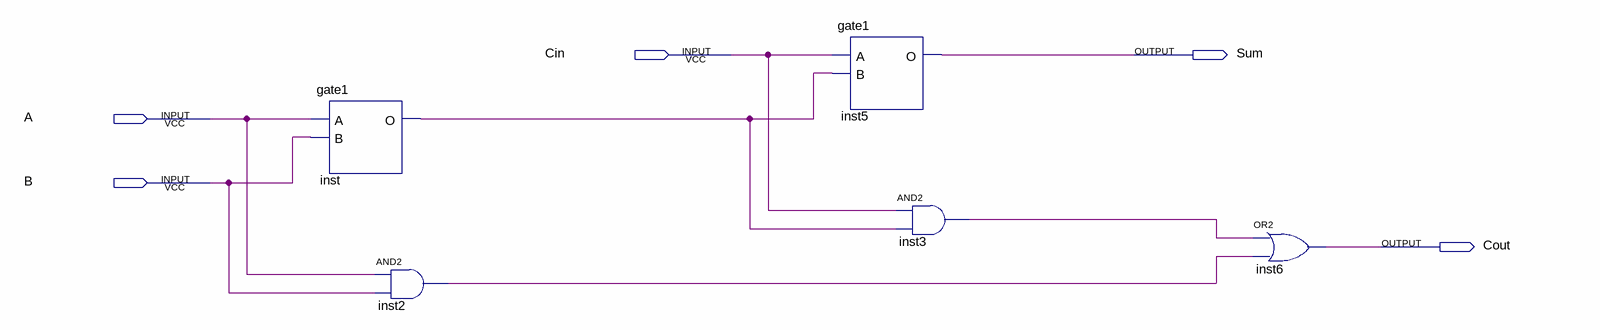
[diagram p0: schematic sheet]
// Quartus schematic FullAdder.bdf as structural Verilog: 5 symbols, 5 pins
module FullAdder (
  input  Cin,
  input  A,
  input  B,
  output Sum,
  output Cout
);

  wire inst2_out, inst3_out, inst_o;

  gate1 inst (.A(A), .B(B), .O(inst_o));
  and inst2 (inst2_out, A, B);
  gate1 inst5 (.A(Cin), .B(inst_o), .O(Sum));
  and inst3 (inst3_out, Cin, inst_o);
  or inst6 (Cout, inst3_out, inst2_out);
endmodule
